# EAGLE schematic Cannula_mother (EAGLE 8.6.0)
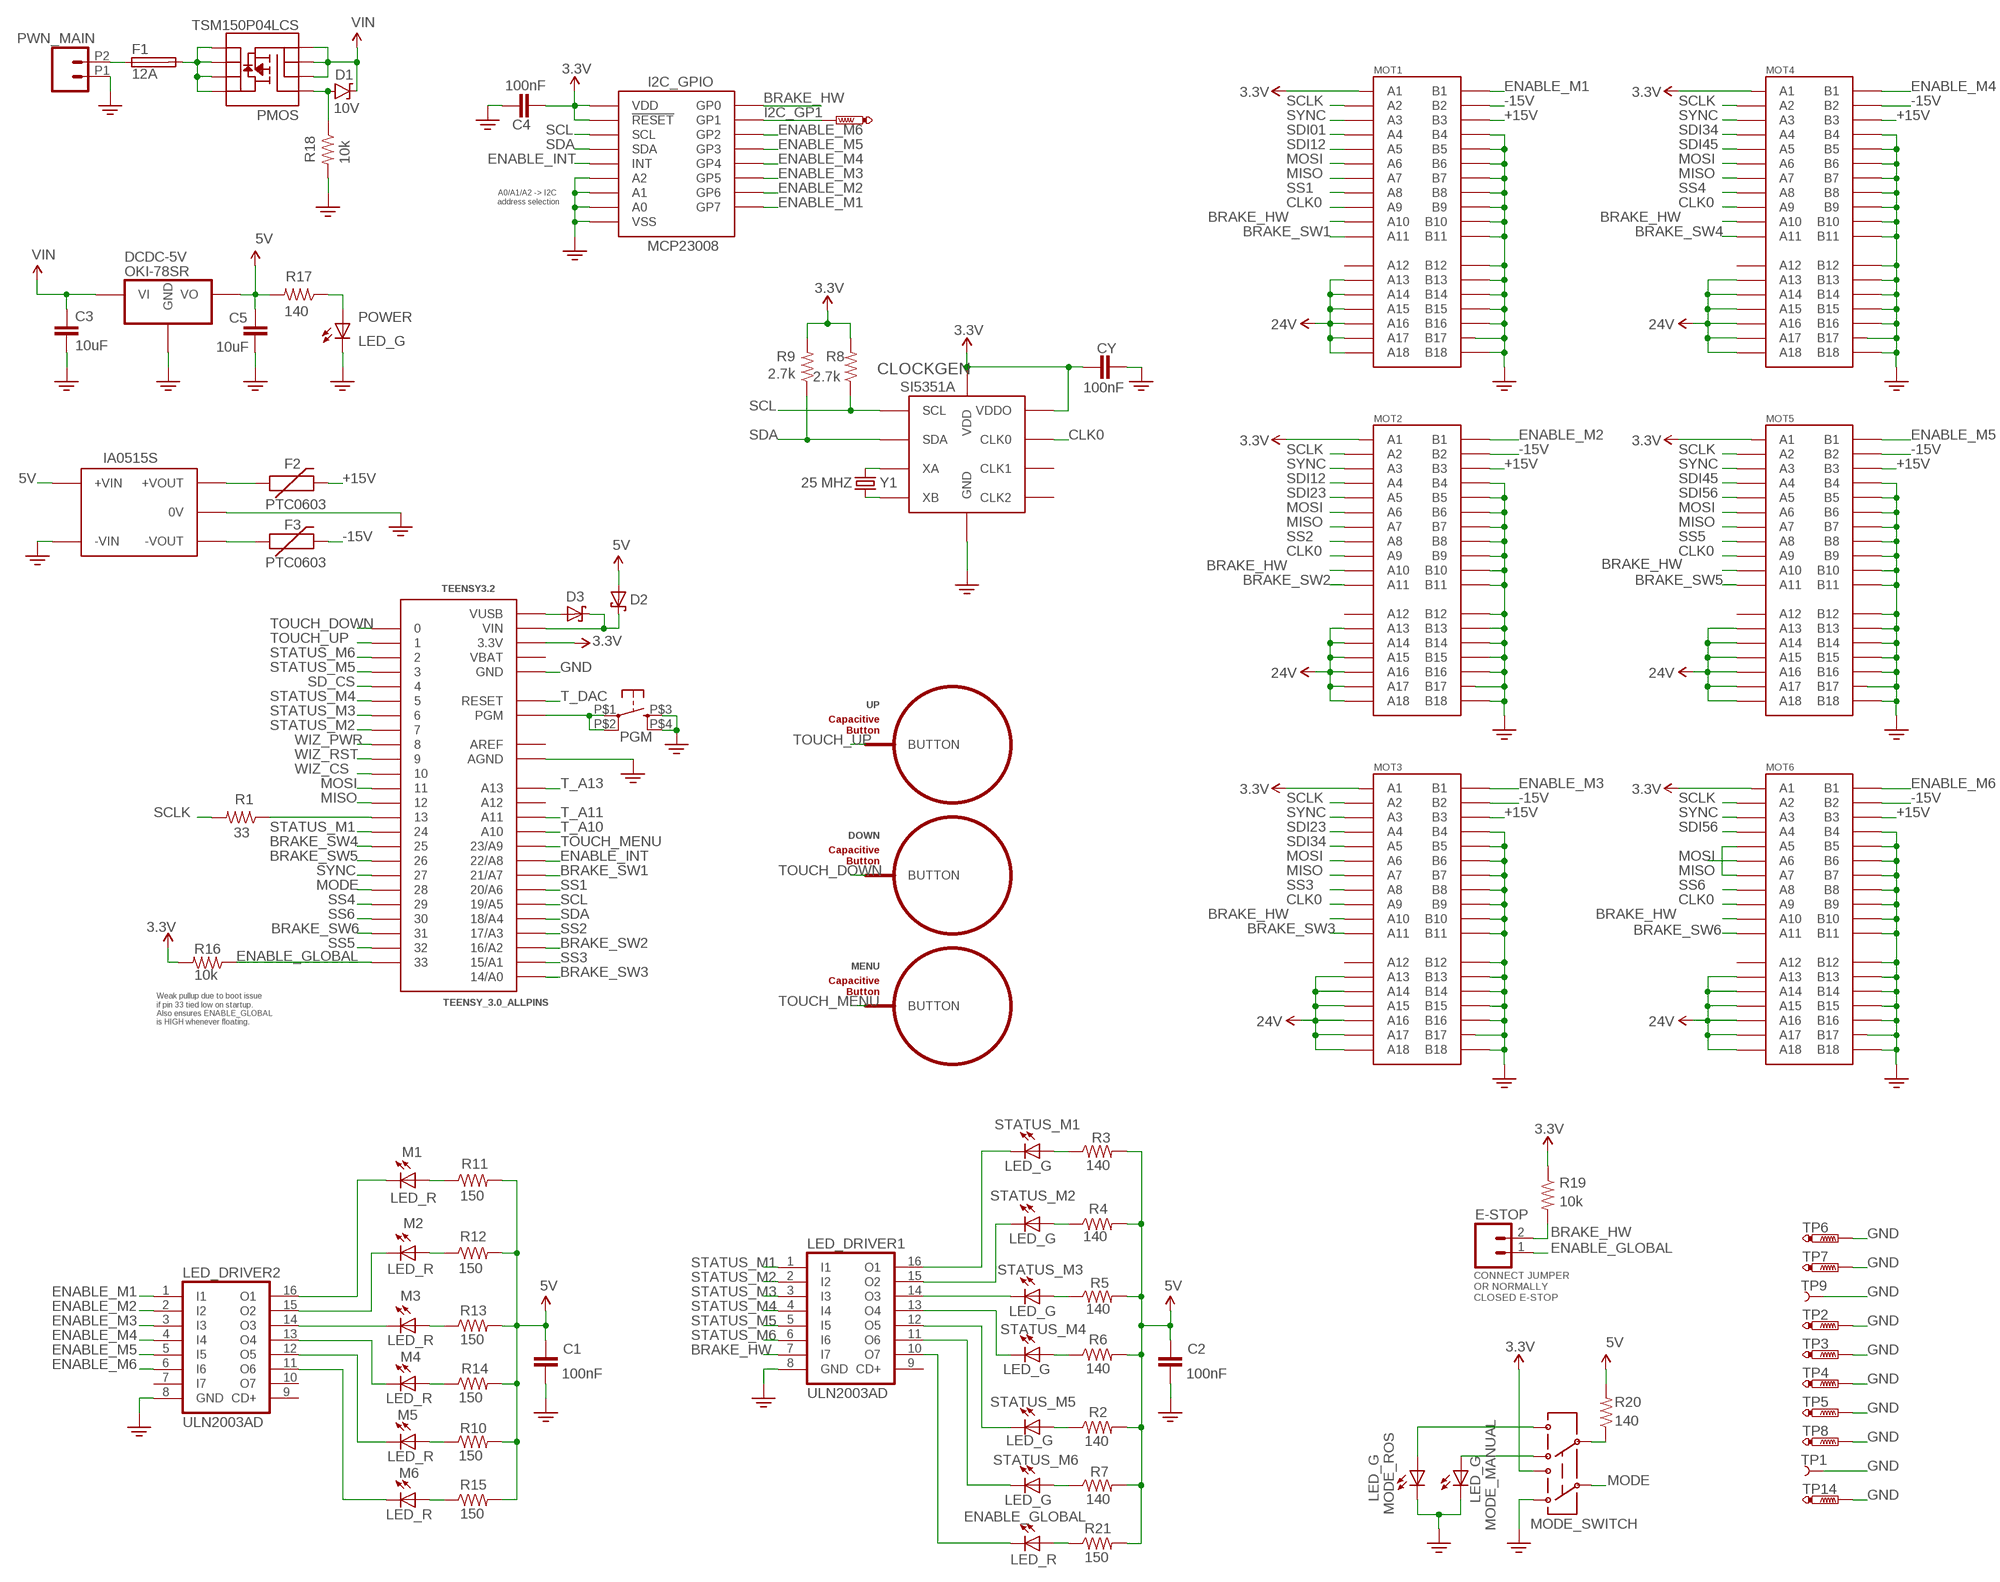
[diagram p0: schematic, sheet 1]

## Parts
C1  100nF  CAP0603-CAP  [0603-CAP]
C2  100nF  CAP0603-CAP  [0603-CAP]
C3  10uF  CAP1210  [1210]
C4  100nF  CAP0603-CAP  [0603-CAP]
C5  10uF  CAP1210  [1210]
CLOCKGEN  SI5351A  [MSOP10]
CY  100nF  CAP0603-CAP  [0603-CAP]
D1  10V  DIODE-ZENER3.3V  [SOD-323]
D2  DIODE-POWERDI123  [POWERDI123]
D3  DIODE-POWERDI123  [POWERDI123]
DCDC-5V  OKI-78SR  VX7805-500_OKI-78SR  [OKI-78SR]
DOWN  BUTTON_PASSIVE-8MM-ARROW  [BUTTON_PASSIVE_8MM_UP]
E-STOP  M02LOCK  [1X02_LOCK]
ENABLE_GLOBAL  LED_R  LED-0805  [LED-0805]
F1  12A  FUSE-1206  [1206]
F2  PTC0603  [0603]
F3  PTC0603  [0603]
I2C_GPIO  MCP23008  [SSOP20]
IA0515S  DCDC_IA_SERIES0515S  [DCDC_IA_SERIES]
LED_DRIVER1  ULN2003AD  [SO16]
LED_DRIVER2  ULN2003AD  [SO16]
M1  LED_R  LED-0805  [LED-0805]
M2  LED_R  LED-0805  [LED-0805]
M3  LED_R  LED-0805  [LED-0805]
M4  LED_R  LED-0805  [LED-0805]
M5  LED_R  LED-0805  [LED-0805]
M6  LED_R  LED-0805  [LED-0805]
MENU  BUTTON_PASSIVE-8MM-MENU  [BUTTON_PASSIVE_8MM_MENU]
MODE_MANUAL  LED_G  LED-0805  [LED-0805]
MODE_ROS  LED_G  LED-0805  [LED-0805]
MODE_SWITCH  SWITCH-DPDT-SLIDER-SMD  [JS202011SCQN]
MOT1  PCIE-36-SKT  [PCIE-36-SKT]
MOT2  PCIE-36-SKT  [PCIE-36-SKT]
MOT3  PCIE-36-SKT  [PCIE-36-SKT]
MOT4  PCIE-36-SKT  [PCIE-36-SKT]
MOT5  PCIE-36-SKT  [PCIE-36-SKT]
MOT6  PCIE-36-SKT  [PCIE-36-SKT]
PGM  SWITCH-TACT  [LS38]
POWER  LED_G  LED-0805  [LED-0805]
PWN_MAIN  M026.35MM_SCREWTERM  [1X02_6.35_SCREWTERM]
R1  33  RESISTOR-0603  [0603-RES]
R2  140  RESISTOR-0603  [0603-RES]
R3  140  RESISTOR-0603  [0603-RES]
R4  140  RESISTOR-0603  [0603-RES]
R5  140  RESISTOR-0603  [0603-RES]
R6  140  RESISTOR-0603  [0603-RES]
R7  140  RESISTOR-0603  [0603-RES]
R8  2.7k  RESISTOR-0603  [0603-RES]
R9  2.7k  RESISTOR-0603  [0603-RES]
R10  150  RESISTOR-0603  [0603-RES]
R11  150  RESISTOR-0603  [0603-RES]
R12  150  RESISTOR-0603  [0603-RES]
R13  150  RESISTOR-0603  [0603-RES]
R14  150  RESISTOR-0603  [0603-RES]
R15  150  RESISTOR-0603  [0603-RES]
R16  10k  RESISTOR-0603  [0603-RES]
R17  140  RESISTOR-0603  [0603-RES]
R18  10k  RESISTOR-0603  [0603-RES]
R19  10k  RESISTOR-0603  [0603-RES]
R20  140  RESISTOR-0603  [0603-RES]
R21  150  RESISTOR-0603  [0603-RES]
STATUS_M1  LED_G  LED-0805  [LED-0805]
STATUS_M2  LED_G  LED-0805  [LED-0805]
STATUS_M3  LED_G  LED-0805  [LED-0805]
STATUS_M4  LED_G  LED-0805  [LED-0805]
STATUS_M5  LED_G  LED-0805  [LED-0805]
STATUS_M6  LED_G  LED-0805  [LED-0805]
TEENSY3.2  TEENSY_3.0_ALLPINS  [TEENSY_3.0_ALLPINS]
TP1  TEST-POINT_5021  [TEST-POINT_5021]
TP2  PTR1TP20R  [TP20R]
TP3  PTR1TP20R  [TP20R]
TP4  PTR1TP20R  [TP20R]
TP5  PTR1TP20R  [TP20R]
TP6  PTR1TP20R  [TP20R]
TP7  PTR1TP20R  [TP20R]
TP8  PTR1TP20R  [TP20R]
TP9  TEST-POINT_5021  [TEST-POINT_5021]
TP10  PTR1TP20R  [TP20R]
TP14  PTR1TP20R  [TP20R]
TSM150P04LCS  PMOS  MOSFET-PCHANNEL-SOIC8SOIC8  [SO08]
UP  BUTTON_PASSIVE-8MM-ARROW  [BUTTON_PASSIVE_8MM_UP]
Y1  25 MHZ  CX3225SB  [CX3225SB]

## Nets
3.3V: C4.1 CLOCKGEN.1(VDD) CLOCKGEN.7(VDDO) CY.1 I2C_GPIO.6(!RESET) I2C_GPIO.20(VDD) MODE_SWITCH.3 MOT1.A1 MOT2.A1 MOT3.A1 MOT4.A1 MOT5.A1 MOT6.A1 R8.2 R9.2 R16.2 R19.1 TEENSY3.2.3.3V TEENSY3.2.3.3V1(3.3V) TEENSY3.2.3.3V2(3.3V)
5V: C1.1 C2.1 C5.1 D2.P$2(A) DCDC-5V.P$3(VO) IA0515S.+VIN R2.2 R3.2 R4.2 R5.2 R6.2 R7.2 R10.2 R11.2 R12.2 R13.2 R14.2 R15.2 R17.2 R20.2 R21.2
+15V: F2.2 MOT1.B3 MOT2.B3 MOT3.B3 MOT4.B3 MOT5.B3 MOT6.B3
-15V: F3.2 MOT1.B2 MOT2.B2 MOT3.B2 MOT4.B2 MOT5.B2 MOT6.B2
BRAKE_HW: E-STOP.2 I2C_GPIO.12(GP0) LED_DRIVER1.7(I7) MOT1.A10 MOT2.A10 MOT3.A10 MOT4.A10 MOT5.A10 MOT6.A10 R19.2
BRAKE_SW1: MOT1.A11 TEENSY3.2.21/A7
BRAKE_SW2: MOT2.A11 TEENSY3.2.16/A2
BRAKE_SW3: MOT3.A11 TEENSY3.2.14/A0
BRAKE_SW4: MOT4.A11 TEENSY3.2.25
BRAKE_SW5: MOT5.A11 TEENSY3.2.26
BRAKE_SW6: MOT6.A11 TEENSY3.2.31
CLK0: CLOCKGEN.10(CLK0) MOT1.A9 MOT2.A9 MOT3.A9 MOT4.A9 MOT5.A9 MOT6.A9
ENABLE_GLOBAL: E-STOP.1 R16.1 TEENSY3.2.33
ENABLE_INT: I2C_GPIO.8(INT) TEENSY3.2.22/A8
ENABLE_M1: I2C_GPIO.19(GP7) LED_DRIVER2.1(I1) MOT1.B1
ENABLE_M2: I2C_GPIO.18(GP6) LED_DRIVER2.2(I2) MOT2.B1
ENABLE_M3: I2C_GPIO.17(GP5) LED_DRIVER2.3(I3) MOT3.B1
ENABLE_M4: I2C_GPIO.16(GP4) LED_DRIVER2.4(I4) MOT4.B1
ENABLE_M5: I2C_GPIO.15(GP3) LED_DRIVER2.5(I5) MOT5.B1
ENABLE_M6: I2C_GPIO.14(GP2) LED_DRIVER2.6(I6) MOT6.B1
GND: C1.2 C2.2 C3.2 C4.2 C5.2 CLOCKGEN.8(GND) CY.2 DCDC-5V.P$2(GND) I2C_GPIO.3(A2) I2C_GPIO.4(A1) I2C_GPIO.5(A0) I2C_GPIO.9(VSS) IA0515S.0V IA0515S.-VIN LED_DRIVER1.8(GND) LED_DRIVER2.8(GND) MODE_MANUAL.C MODE_ROS.C MODE_SWITCH.1 MOT1.B4 MOT1.B5 MOT1.B6 MOT1.B7 MOT1.B8 MOT1.B9 MOT1.B10 MOT1.B11 MOT1.B12 MOT1.B13 MOT1.B14 MOT1.B15 MOT1.B16 MOT1.B17 MOT1.B18 MOT2.B4 MOT2.B5 MOT2.B6 MOT2.B7 MOT2.B8 MOT2.B9 MOT2.B10 MOT2.B11 MOT2.B12 MOT2.B13 MOT2.B14 MOT2.B15 MOT2.B16 MOT2.B17 MOT2.B18 MOT3.B4 MOT3.B5 MOT3.B6 MOT3.B7 MOT3.B8 MOT3.B9 MOT3.B10 MOT3.B11 MOT3.B12 MOT3.B13 MOT3.B14 MOT3.B15 MOT3.B16 MOT3.B17 MOT3.B18 MOT4.B4 MOT4.B5 MOT4.B6 MOT4.B7 MOT4.B8 MOT4.B9 MOT4.B10 MOT4.B11 MOT4.B12 MOT4.B13 MOT4.B14 MOT4.B15 MOT4.B16 MOT4.B17 MOT4.B18 MOT5.B4 MOT5.B5 MOT5.B6 MOT5.B7 MOT5.B8 MOT5.B9 MOT5.B10 MOT5.B11 MOT5.B12 MOT5.B13 MOT5.B14 MOT5.B15 MOT5.B16 MOT5.B17 MOT5.B18 MOT6.B4 MOT6.B5 MOT6.B6 MOT6.B7 MOT6.B8 MOT6.B9 MOT6.B10 MOT6.B11 MOT6.B12 MOT6.B13 MOT6.B14 MOT6.B15 MOT6.B16 MOT6.B17 MOT6.B18 PGM.P$3 PGM.P$4 POWER.C PWN_MAIN.P1 R18.2 TEENSY3.2.AGND TEENSY3.2.GND TEENSY3.2.GND1(GND) TEENSY3.2.GND2(GND) TP1.P$1 TP2.TP TP3.TP TP4.TP TP5.TP TP6.TP TP7.TP TP8.TP TP9.P$1 TP14.TP ; supply symbol labelled GND2
I2C_GP1: I2C_GPIO.13(GP1) TP10.TP
MISO: MOT1.A7 MOT2.A7 MOT3.A7 MOT4.A7 MOT5.A7 MOT6.A5 MOT6.A7 TEENSY3.2.12
MODE: MODE_SWITCH.2 TEENSY3.2.28
MOSI: MOT1.A6 MOT2.A6 MOT3.A6 MOT4.A6 MOT5.A6 MOT6.A6 TEENSY3.2.11
N$1: F2.1 IA0515S.+VOUT
N$2: F3.1 IA0515S.-VOUT
N$3: LED_DRIVER2.14(O3) M3.C
N$5: ENABLE_GLOBAL.A R21.1
N$6: D1.A R18.1 TSM150P04LCS.4(G)
N$7: LED_DRIVER1.14(O3) STATUS_M3.C
N$8: F1.P$2 TSM150P04LCS.5(D) TSM150P04LCS.6(D) TSM150P04LCS.7(D) TSM150P04LCS.8(D)
N$9: POWER.A R17.1
N$11: ENABLE_GLOBAL.C LED_DRIVER1.10(O7)
N$12: MODE_SWITCH.5 R20.1
N$13: MODE_MANUAL.A MODE_SWITCH.4
N$14: MODE_ROS.A MODE_SWITCH.6
N$17: D2.P$1(C) D3.P$1(C) TEENSY3.2.VIN
N$18: F1.P$1 PWN_MAIN.P2
N$19: R2.1 STATUS_M5.A
N$20: R3.1 STATUS_M1.A
N$21: R4.1 STATUS_M2.A
N$22: R5.1 STATUS_M3.A
N$23: R6.1 STATUS_M4.A
N$24: R7.1 STATUS_M6.A
N$25: D3.P$2(A) TEENSY3.2.VUSB
N$55: M5.A R10.1
N$56: M1.A R11.1
N$57: M2.A R12.1
N$58: M3.A R13.1
N$59: M4.A R14.1
N$60: M6.A R15.1
N$63: LED_DRIVER1.16(O1) STATUS_M1.C
N$64: LED_DRIVER1.15(O2) STATUS_M2.C
N$66: LED_DRIVER1.13(O4) STATUS_M4.C
N$67: LED_DRIVER1.12(O5) STATUS_M5.C
N$68: LED_DRIVER1.11(O6) STATUS_M6.C
N$69: LED_DRIVER2.15(O2) M2.C
N$71: LED_DRIVER2.13(O4) M4.C
N$72: LED_DRIVER2.12(O5) M5.C
N$73: LED_DRIVER2.11(O6) M6.C
N$74: LED_DRIVER2.16(O1) M1.C
N$99: R1.1 TEENSY3.2.13
PGM: PGM.P$1 PGM.P$2 TEENSY3.2.PGM
SCL: CLOCKGEN.4(SCL) I2C_GPIO.1(SCL) R8.1 TEENSY3.2.19/A5
SCLK: MOT1.A2 MOT2.A2 MOT3.A2 MOT4.A2 MOT5.A2 MOT6.A2 R1.2
SD_CS: TEENSY3.2.4
SDA: CLOCKGEN.5(SDA) I2C_GPIO.2(SDA) R9.1 TEENSY3.2.18/A4
SDI01: MOT1.A4
SDI12: MOT1.A5 MOT2.A4
SDI23: MOT2.A5 MOT3.A4
SDI34: MOT3.A5 MOT4.A4
SDI45: MOT4.A5 MOT5.A4
SDI56: MOT5.A5 MOT6.A4
SS1: MOT1.A8 TEENSY3.2.20/A6
SS2: MOT2.A8 TEENSY3.2.17/A3
SS3: MOT3.A8 TEENSY3.2.15/A1
SS4: MOT4.A8 TEENSY3.2.29
SS5: MOT5.A8 TEENSY3.2.32
SS6: MOT6.A8 TEENSY3.2.30
STATUS_M1: LED_DRIVER1.1(I1) TEENSY3.2.24
STATUS_M2: LED_DRIVER1.2(I2) TEENSY3.2.7
STATUS_M3: LED_DRIVER1.3(I3) TEENSY3.2.6
STATUS_M4: LED_DRIVER1.4(I4) TEENSY3.2.5
STATUS_M5: LED_DRIVER1.5(I5) TEENSY3.2.3
STATUS_M6: LED_DRIVER1.6(I6) TEENSY3.2.2
SYNC: MOT1.A3 MOT2.A3 MOT3.A3 MOT4.A3 MOT5.A3 MOT6.A3 TEENSY3.2.27
T_A10: TEENSY3.2.A10
T_A11: TEENSY3.2.A11
T_A13: TEENSY3.2.A13
T_DAC: TEENSY3.2.RESET
TOUCH_DOWN: DOWN.BUTTON TEENSY3.2.0
TOUCH_MENU: MENU.BUTTON TEENSY3.2.23/A9
TOUCH_UP: TEENSY3.2.1 UP.BUTTON
VIN: C3.1 D1.C DCDC-5V.P$1(VI) MOT1.A13 MOT1.A14 MOT1.A15 MOT1.A16 MOT1.A17 MOT1.A18 MOT2.A13 MOT2.A14 MOT2.A15 MOT2.A16 MOT2.A17 MOT2.A18 MOT3.A13 MOT3.A14 MOT3.A15 MOT3.A16 MOT3.A17 MOT3.A18 MOT4.A13 MOT4.A14 MOT4.A15 MOT4.A16 MOT4.A17 MOT4.A18 MOT5.A13 MOT5.A14 MOT5.A15 MOT5.A16 MOT5.A17 MOT5.A18 MOT6.A13 MOT6.A14 MOT6.A15 MOT6.A16 MOT6.A17 MOT6.A18 TSM150P04LCS.1(S) TSM150P04LCS.2(S) TSM150P04LCS.3(S) ; supply symbol labelled 24V
WIZ_CS: TEENSY3.2.10
WIZ_PWR: TEENSY3.2.8
WIZ_RST: TEENSY3.2.9
XA: CLOCKGEN.2(XA) Y1.HOT2
XB: CLOCKGEN.3(XB) Y1.HOT1
Unconnected: CLOCKGEN.6(CLK2) CLOCKGEN.9(CLK1) LED_DRIVER1.9(CD+) LED_DRIVER2.7(I7) LED_DRIVER2.9(CD+) LED_DRIVER2.10(O7) MOT1.A12 MOT2.A12 MOT3.A12 MOT4.A12 MOT5.A12 MOT6.A12 TEENSY3.2.A12

## Notes on the sheet
- A0/A1/A2 -> I2C 
  address selection
- Weak pullup due to boot issue 
  if pin 33 tied low on startup.
  Also ensures ENABLE_GLOBAL
  is HIGH whenever floating.
- CONNECT JUMPER
  OR NORMALLY
  CLOSED E-STOP

## Power pins joined to a net without a drawn wire
AREF: TEENSY3.2.AREF
VBAT: TEENSY3.2.VBAT

## Library data of the parts
C1 C2 C4 CY = SparkFun-Capacitors:CAP: Capacitor Standard 0603 ceramic capacitor, and 0.1" leaded capacitor.
C3 C5 = SparkFun-Passives:CAP: Capacitor Standard 0603 ceramic capacitor, and 0.1" leaded capacitor.
CLOCKGEN = Cannula_1_0:SI5351A
D1 = SparkFun-DiscreteSemi:DIODE-ZENER: Zener Diode Production Part - 8199 3.4V Zener Voltage; PROD_ID: DIO-11284; VALUE: 3.3V
D2 D3 = Cannula_1_0:DIODE
DCDC-5V = Cannula_1_0:VX7805-500
DOWN MENU UP = Cannula_1_0:BUTTON_PASSIVE: Button, Passive Capacitive/Touch Sensing Type Source : http://www.PatternAgents.com Github : https://github.com/PatternAgents License : http://creativecommons.org/licenses/by-sa/3.1/ (Creative Commons 3.1) THIS SOFTWARE IS PROVIDED BY THE CONTRIBUTORS "AS IS" AND WITHOUT ANY EXPRESS OR IMPLIED WARRANTIES, INCLUDING, BUT NOT LIMITED TO, THE IMPLIED WARRANTIES OF MERCHANTABILITY AND FITNESS FOR A PARTICULAR PURPOSE ARE DISCLAIMED. IN NO EVENT SHALL THE COPYRIGHT OWNER OR CONTRIBUTORS BE LIABLE FOR ANY DIRECT, INDIRECT, INCIDENTAL, SPECIAL, EXEMPLARY, OR CONSEQUENTIAL DAMAGES (INCLUDING, BUT NOT LIMITED TO, PROCUREMENT OF SUBSTITUTE GOODS OR SERVICES; LOSS OF USE, DATA, OR PROFITS; OR BUSINESS INTERRUPTION) HOWEVER CAUSED AND ON ANY THEORY OF LIABILITY, WHETHER IN CONTRACT, STRICT LIABILITY, OR TORT (INCLUDING NEGLIGENCE OR OTHERWISE) ARISING IN ANY WAY OUT OF THE USE OF THIS SOFTWARE, EVEN IF ADVISED OF THE POSSIBILITY OF SUCH DAMAGE.
E-STOP PWN_MAIN = Cannula_1_0:M02: Standard 2-pin 0.1" header. Use with - straight break away headers ( PRT-00116) - right angle break away headers (PRT-00553) - swiss pins (PRT-00743) - machine pins (PRT-00117) - female headers (PRT-00115) Molex polarized connector foot print use with: PRT-08233 with associated crimp pins and housings. 2.54_SCREWTERM for use with PRT-10571. 3.5mm Screw Terminal footprints for PRT-08084 5mm Screw Terminal footprints for use with PRT-08433
ENABLE_GLOBAL M1-M6 MODE_MANUAL MODE_ROS POWER STATUS_M1-STATUS_M6 = Cannula_1_0:LED
F1 = Cannula_1_0:FUSE: FUSE Part Numbers 1206: F1626CT-ND <http://www.littelfuse.com/~/media/electronics/datasheets/fuses/littelfuse_fuse_501_datasheet.pdf.pdf> Trevor Bruns 6/2/15
F2 F3 = SparkFun-PowerIC:PTC: Resettable Fuse PTC Resettable Fuse. Spark Fun Electronics SKU : COM-08357
I2C_GPIO = Cannula_1_0:MCP23008
IA0515S = Cannula_1_0:DCDC_IA_SERIES
LED_DRIVER1 LED_DRIVER2 = Cannula_1_0:ULN2003A: DRIVER ARRAY
MODE_SWITCH = Cannula_1_0:SWITCH-DPDT
MOT1-MOT6 = Cannula_1_0:PCIE-36-*: PCI-E 36-way connectors
PGM = Cannula_1_0:SWITCH-TACT
R1-R21 = Cannula_1_0:RESISTOR
TEENSY3.2 = Cannula_1_0:TEENSY_3.0_ALLPINS: Teensy 3.0 with all pin holes and optional SMD-mount unshrouded header on bottom of Teensy 3.0. For more basic versions, see 'Basic', '+4' and 'AllAnalogPins'. Requires the installation of a un-shrouded SMD header on the underside of the Teensy 3.0
TP1 TP9 = Cannula_1_0:TEST-POINT: Bare copper test points for troubleshooting or ICT
TP2-TP8 TP10 TP14 = testpad:PTR1: TEST PIN
TSM150P04LCS = SparkFun-DiscreteSemi:MOSFET-PCHANNEL-SOIC8: Generic 8-pin PMOSFET
Y1 = Cannula_1_0:CX3225SB: CX3225SB Kyocera SMD Quartz Crystal Datasheet <http://media.digikey.com/pdf/Data%20Sheets/Optrex%20PDFs/CX3225SByyy00D0FFFCC_Spec.pdf>

## Net classes
1 differential: width 0.152 mm, clearance 0.203 mm